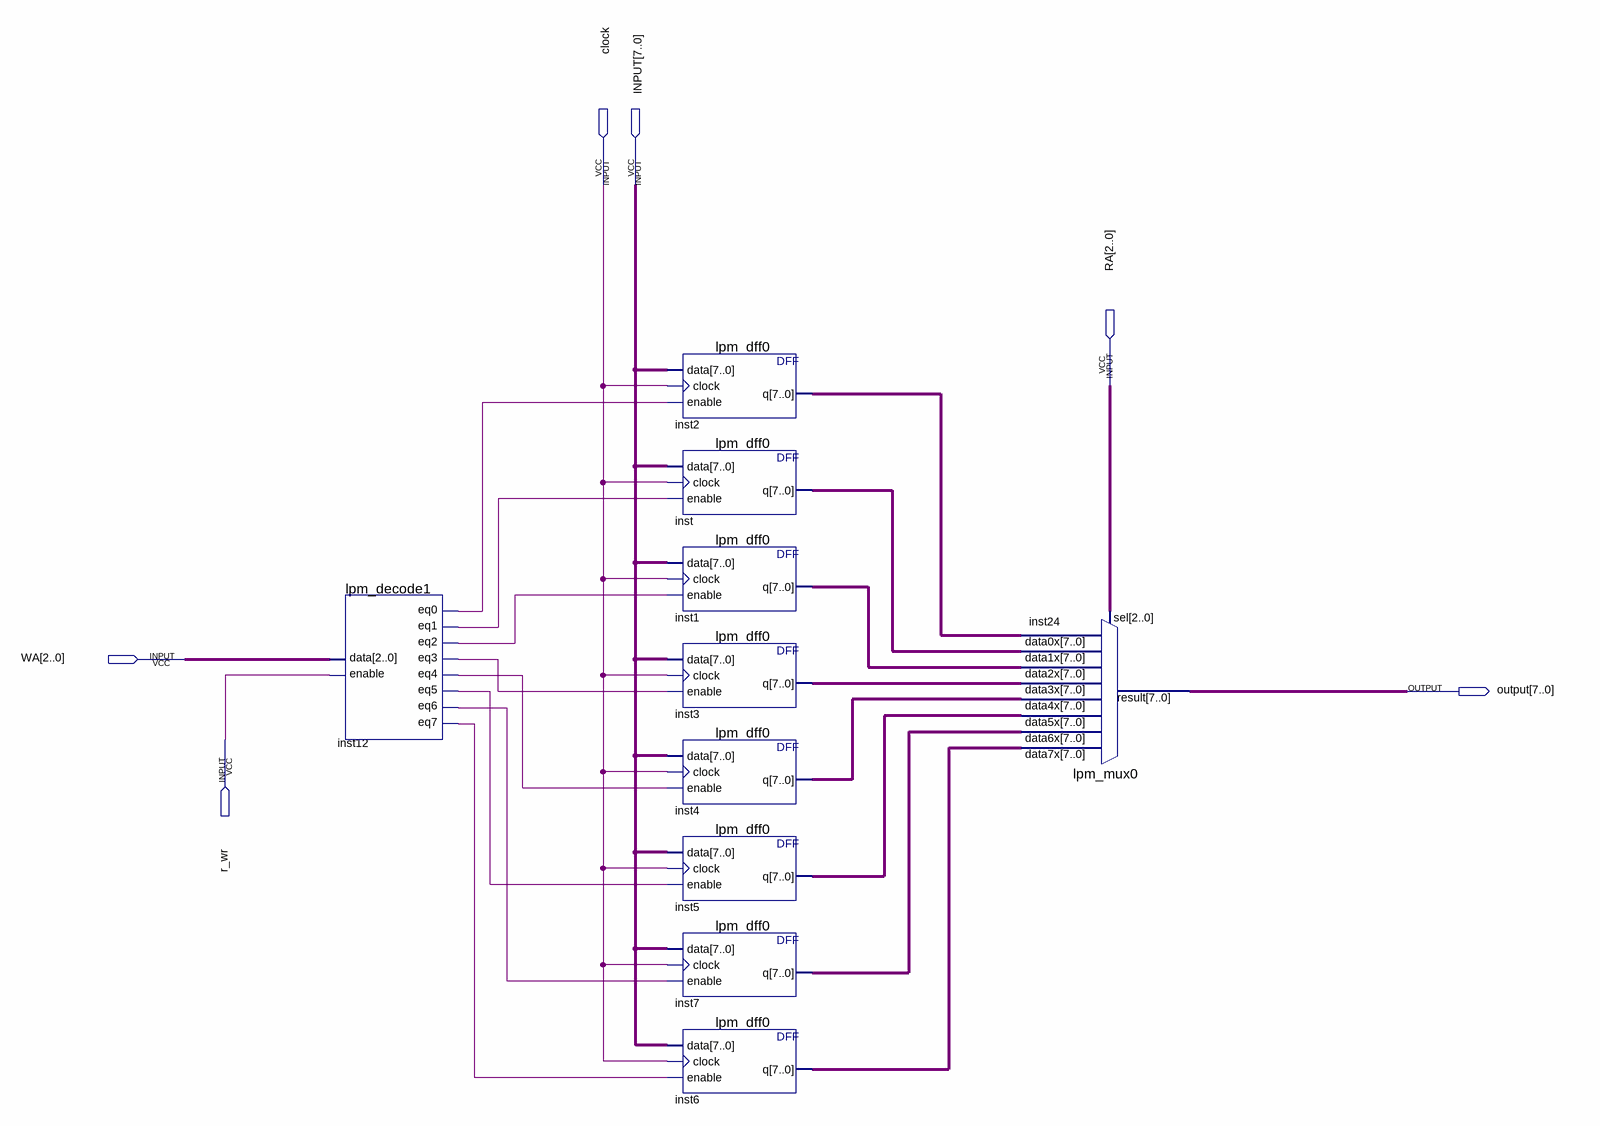
[diagram p0: schematic sheet]
// Quartus schematic cos_lab1.bdf as structural Verilog: 10 symbols, 6 pins
module cos_lab1 (
  input  clock,
  input  [7:0] INPUT,
  input  [2:0] RA,
  input  [2:0] WA,
  input  r_wr,
  output [7:0] \output 
);

  wire inst12_eq0, inst12_eq1, inst12_eq2, inst12_eq3, inst12_eq4, inst12_eq5, inst12_eq6, inst12_eq7;
  wire [7:0] inst1_q, inst2_q, inst3_q, inst4_q, inst5_q, inst6_q, inst7_q, inst_q;

  lpm_decode1 inst12 (
    .data(WA), .enable(r_wr), .eq0(inst12_eq0), .eq1(inst12_eq1), .eq2(inst12_eq2), .eq3(inst12_eq3),
    .eq4(inst12_eq4), .eq5(inst12_eq5), .eq6(inst12_eq6), .eq7(inst12_eq7));
  lpm_dff0 inst2 (.data(INPUT), .clock(clock), .enable(inst12_eq0), .q(inst2_q));
  lpm_dff0 inst (.data(INPUT), .clock(clock), .enable(inst12_eq1), .q(inst_q));
  lpm_dff0 inst1 (.data(INPUT), .clock(clock), .enable(inst12_eq2), .q(inst1_q));
  lpm_dff0 inst3 (.data(INPUT), .clock(clock), .enable(inst12_eq3), .q(inst3_q));
  lpm_dff0 inst4 (.data(INPUT), .clock(clock), .enable(inst12_eq4), .q(inst4_q));
  lpm_dff0 inst5 (.data(INPUT), .clock(clock), .enable(inst12_eq5), .q(inst5_q));
  lpm_dff0 inst7 (.data(INPUT), .clock(clock), .enable(inst12_eq6), .q(inst7_q));
  lpm_dff0 inst6 (.data(INPUT), .clock(clock), .enable(inst12_eq7), .q(inst6_q));
  lpm_mux0 inst24 (
    .data7x(inst6_q), .data6x(inst7_q), .data5x(inst5_q), .data4x(inst4_q), .data3x(inst3_q),
    .data2x(inst1_q), .data1x(inst_q), .data0x(inst2_q), .sel(RA), .result(\output ));
endmodule
